# Altium schematic sheet SH8 - FORCE SENSITIVE RESISTOR.SchDoc: Force Sensitive Resistor
size B; CheckedBy: Lance Bantoto; DrawnBy: Kyle Hong; Organization: UW Robotics; Address1: 200 University Avenue; Address2: Waterloo; Address3: Ontario; Address4: Canada N2L 3G6; Revision: 2; SheetNumber: 8; SheetTotal: 8
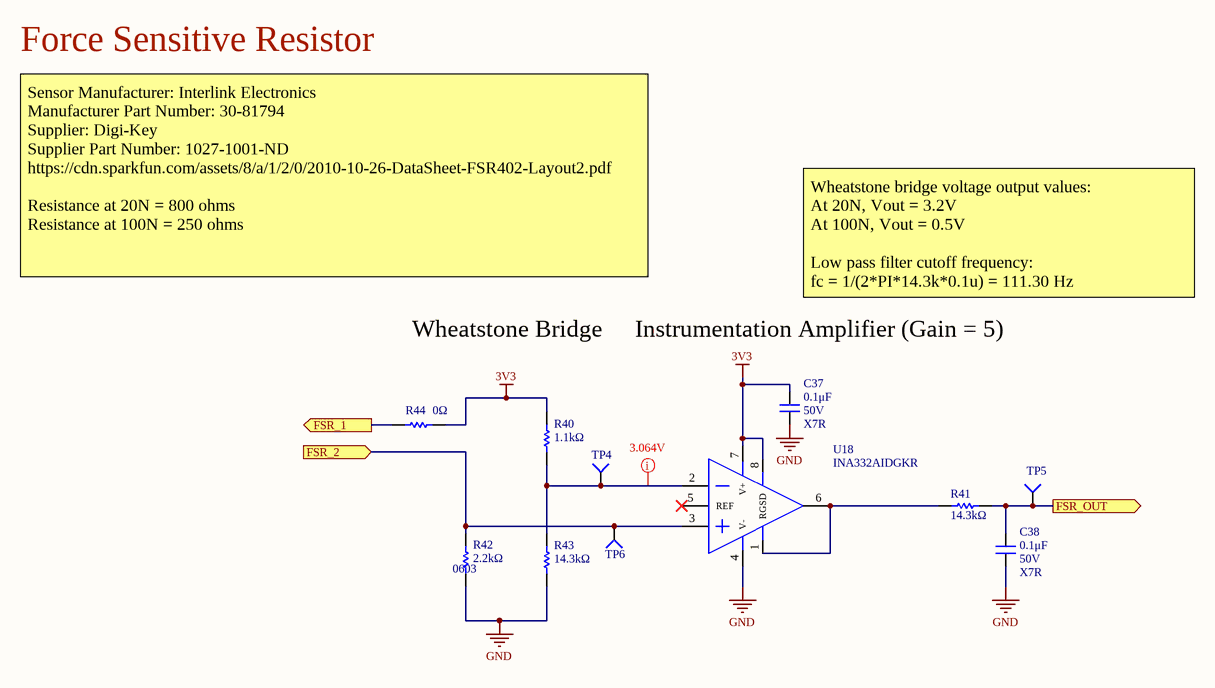
[diagram p0: SH8 - FORCE SENSITIVE RESISTOR.SchDoc]

## Parts
C37  value 0.1μF  Voltage Rating: 50V  Dielectric: X7R  [CAP0603]  (hidden comment: CAP_0.1uF_50V_0603)
C38  value 0.1μF  Voltage Rating: 50V  Dielectric: X7R  [CAP0603]  (hidden comment: CAP_0.1uF_50V_0603)
R40  value 1.1kΩ  [RESC0603]  (hidden comment: RES_1.1kΩ_0603_1%)
R41  value 14.3kΩ  [RESC0603]  (hidden comment: RES_14.3kΩ_0603_1%)
R42  value 2.2kΩ  Package/Footprint: 0603  [RESC0603]  (hidden comment: RES_2.2kΩ_0603_1%)
R43  value 14.3kΩ  [RESC0603]  (hidden comment: RES_14.3kΩ_0603_1%)
R44  value 0Ω  [RESC0603]  (hidden comment: RES_0Ω_0603)
TP4  TESTPOINT_1MM_CIRCLE  [TESTPOINT_CIRCLE_1MM]  (value not drawn)  (no BOM)
TP5  TESTPOINT_1MM_CIRCLE  [TESTPOINT_CIRCLE_1MM]  (value not drawn)  (no BOM)
TP6  TESTPOINT_1MM_CIRCLE  [TESTPOINT_CIRCLE_1MM]  (value not drawn)  (no BOM)
U18  INA332AIDGKR  [INA332AIDGKR]

## Ports
FSR_1 (out), FSR_2 (in), FSR_OUT (out)

## Nets
3V3: C37.2 R40.2 R44.1 U18.7(V+) U18.8(SD)
GND: C37.1 C38.1 R42.1 R43.1 U18.4(V-)
FSR_1: R44.2 ; port FSR_1
FSR_2: R42.2 TP6.1(=value) U18.3(IN+) ; port FSR_2
FSR_OUT: C38.2 R41.2 TP5.1(=value) ; port FSR_OUT
NetR40_1: R40.1 R43.2 TP4.1(=value) U18.2(IN-)
NetR41_1: R41.1 U18.1(RG) U18.6(Vout)

Not connected (* = marked no-connect by the designer): U18 5(REF)*

## Layout directives
mark named 3.064V: NetR40_1

## Notes on the sheet
- Force Sensitive Resistor
- Sensor Manufacturer: Interlink Electronics
  Manufacturer Part Number: 30-81794
  Supplier: Digi-Key
  Supplier Part Number: 1027-1001-ND
  https://cdn.sparkfun.com/assets/8/a/1/2/0/2010-10-26-DataSheet-FSR402-Layout2.pdf
  Resistance at 20N = 800 ohms
  Resistance at 100N = 250 ohms
- Wheatstone bridge voltage output values:
  At 20N, Vout = 3.2V
  At 100N, Vout = 0.5V
  Low pass filter cutoff frequency:
  fc = 1/(2*PI*14.3k*0.1u) = 111.30 Hz
- Wheatstone Bridge
- Instrumentation Amplifier (Gain = 5)
- Title:
- Project:
- Date:
- Rev:
- Reviewer:
- Engineer:
- Sheet:
- of

## Library data of the parts
C37 C38 = CAP_0.1uF_50V_0603: CAP CER 0.1UF 50V X7R 0603; Manufacturer Part Number 1: CC0603KRX7R9BB104; Manufacturer 1: Yageo; Package/Footprint: 0603; Supplier Part Number 1: 311-1344-1-ND; Supplier 1: Digi-Key; Mounting Type: SMD
R40 = RES_1.1kΩ_0603_1%: RES 1.1K OHM 1% 1/10W 0603; Manufacturer 1: Yageo; Manufacturer Part Number 1: RC0603FR-071K1L; Package/Footprint: 0603; Supplier Part Number 1: 311-1.10KHRCT-ND; Supplier 1: Digi-Key; Mounting Type: SMD
R41 R43 = RES_14.3kΩ_0603_1%: RES 14.3K OHM 1% 1/10W 0603; Manufacturer 1: Yageo; Manufacturer Part Number 1: RC0603FR-0714K3L; Package/Footprint: 0603; Supplier Part Number 1: 311-14.3KHRCT-ND; Supplier 1: Digi-Key; Mounting Type: SMD
R42 = RES_2.2kΩ_0603_1%: RES 2.2K OHM 1% 1/10W 0603; Manufacturer 1: Yageo; Manufacturer Part Number 1: RC0603FR-072K2L; Supplier Part Number 1: 311-2.20KHRCT-ND; Supplier 1: Digi-Key; Mounting Type: SMD
R44 = RES_0Ω_0603: RES 0 OHM JUMPER 1/10W 0603; Manufacturer 1: Yageo; Manufacturer Part Number 1: RC0603JR-070RL; Package/Footprint: 0603; Supplier Part Number 1: 311-0.0GRCT-ND; Supplier 1: Digi-Key; Mounting Type: SMD
TP4-TP6 = TESTPOINT_1MM_CIRCLE: TESTPOINT 1MM CIRCLE
U18 = INA332AIDGKR: IC INSTRUMENTATION AMP 1 CIRCUIT 8VSSOP; Manufacturer 1: Texas Instruments; Package/Footprint: 8-VSSOP; Supplier 1: Digi-Key; Supplier Part Number 1: 296-41265-1-ND; Manufacturer Part Number 1: INA332AIDGKR; Mounting Type: SMD